# Altium schematic sheet 18-AM64x-07.SchDoc
size B; SheetNumber: 18; SheetTotal: 25
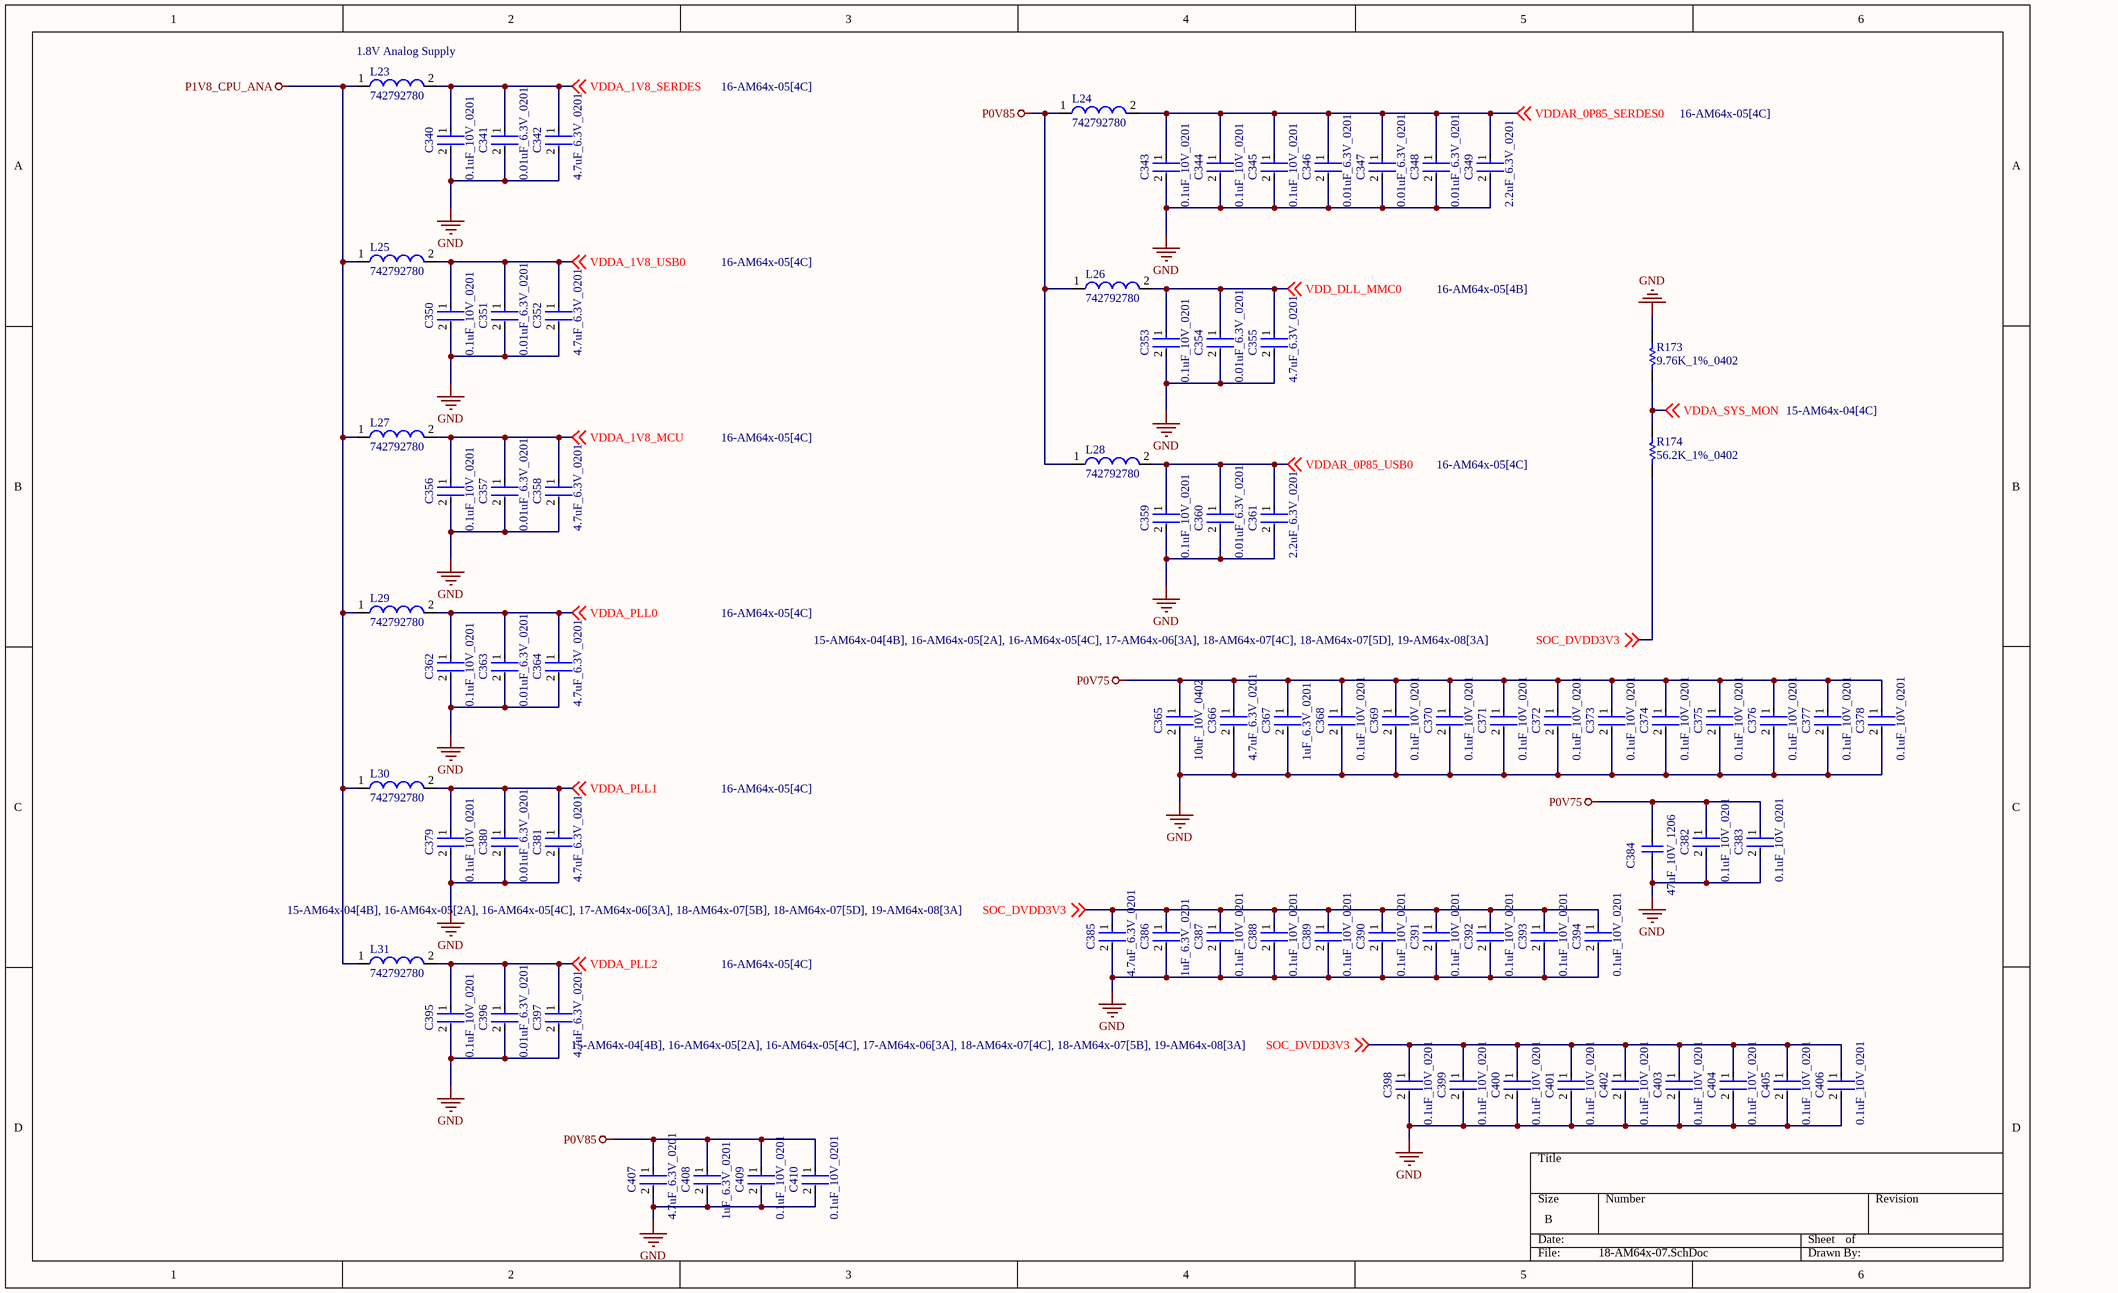
[diagram p0: 18-AM64x-07.SchDoc]

## Parts
C340  0.1uF_10V_0201  [FP-GRM033-0_03-IPC_C]
C341  0.01uF_6.3V_0201  [FP-GRM033-0_03-IPC_A]
C342  4.7uF_6.3V_0201  [FP-GRM035-0_09-IPC_B]
C343  0.1uF_10V_0201  [FP-GRM033-0_03-IPC_C]
C344  0.1uF_10V_0201  [FP-GRM033-0_03-IPC_C]
C345  0.1uF_10V_0201  [FP-GRM033-0_03-IPC_C]
C346  0.01uF_6.3V_0201  [FP-GRM033-0_03-IPC_A]
C347  0.01uF_6.3V_0201  [FP-GRM033-0_03-IPC_A]
C348  0.01uF_6.3V_0201  [FP-GRM033-0_03-IPC_A]
C349  2.2uF_6.3V_0201  [FP-CL03-IPC_C]
C350  0.1uF_10V_0201  [FP-GRM033-0_03-IPC_C]
C351  0.01uF_6.3V_0201  [FP-GRM033-0_03-IPC_A]
C352  4.7uF_6.3V_0201  [FP-GRM035-0_09-IPC_B]
C353  0.1uF_10V_0201  [FP-GRM033-0_03-IPC_C]
C354  0.01uF_6.3V_0201  [FP-GRM033-0_03-IPC_A]
C355  4.7uF_6.3V_0201  [FP-GRM035-0_09-IPC_B]
C356  0.1uF_10V_0201  [FP-GRM033-0_03-IPC_C]
C357  0.01uF_6.3V_0201  [FP-GRM033-0_03-IPC_A]
C358  4.7uF_6.3V_0201  [FP-GRM035-0_09-IPC_B]
C359  0.1uF_10V_0201  [FP-GRM033-0_03-IPC_C]
C360  0.01uF_6.3V_0201  [FP-GRM033-0_03-IPC_A]
C361  2.2uF_6.3V_0201  [FP-CL03-IPC_C]
C362  0.1uF_10V_0201  [FP-GRM033-0_03-IPC_C]
C363  0.01uF_6.3V_0201  [FP-GRM033-0_03-IPC_A]
C364  4.7uF_6.3V_0201  [FP-GRM035-0_09-IPC_B]
C365  10uF_10V_0402  [FP-CL05A106MP5NUNC-MFG]
C366  4.7uF_6.3V_0201  [FP-GRM035-0_09-IPC_B]
C367  1uF_6.3V_0201  [FP-CL03-IPC_B]
C368  0.1uF_10V_0201  [FP-GRM033-0_03-IPC_C]
C369  0.1uF_10V_0201  [FP-GRM033-0_03-IPC_C]
C370  0.1uF_10V_0201  [FP-GRM033-0_03-IPC_C]
C371  0.1uF_10V_0201  [FP-GRM033-0_03-IPC_C]
C372  0.1uF_10V_0201  [FP-GRM033-0_03-IPC_C]
C373  0.1uF_10V_0201  [FP-GRM033-0_03-IPC_C]
C374  0.1uF_10V_0201  [FP-GRM033-0_03-IPC_C]
C375  0.1uF_10V_0201  [FP-GRM033-0_03-IPC_C]
C376  0.1uF_10V_0201  [FP-GRM033-0_03-IPC_C]
C377  0.1uF_10V_0201  [FP-GRM033-0_03-IPC_C]
C378  0.1uF_10V_0201  [FP-GRM033-0_03-IPC_C]
C379  0.1uF_10V_0201  [FP-GRM033-0_03-IPC_C]
C380  0.01uF_6.3V_0201  [FP-GRM033-0_03-IPC_A]
C381  4.7uF_6.3V_0201  [FP-GRM035-0_09-IPC_B]
C382  0.1uF_10V_0201  [FP-GRM033-0_03-IPC_C]
C383  0.1uF_10V_0201  [FP-GRM033-0_03-IPC_C]
C384  47uF_10V_1206  [CAPC1206(3216)190_N]
C385  4.7uF_6.3V_0201  [FP-GRM035-0_09-IPC_B]
C386  1uF_6.3V_0201  [FP-CL03-IPC_B]
C387  0.1uF_10V_0201  [FP-GRM033-0_03-IPC_C]
C388  0.1uF_10V_0201  [FP-GRM033-0_03-IPC_C]
C389  0.1uF_10V_0201  [FP-GRM033-0_03-IPC_C]
C390  0.1uF_10V_0201  [FP-GRM033-0_03-IPC_C]
C391  0.1uF_10V_0201  [FP-GRM033-0_03-IPC_C]
C392  0.1uF_10V_0201  [FP-GRM033-0_03-IPC_C]
C393  0.1uF_10V_0201  [FP-GRM033-0_03-IPC_C]
C394  0.1uF_10V_0201  [FP-GRM033-0_03-IPC_C]
C395  0.1uF_10V_0201  [FP-GRM033-0_03-IPC_C]
C396  0.01uF_6.3V_0201  [FP-GRM033-0_03-IPC_A]
C397  4.7uF_6.3V_0201  [FP-GRM035-0_09-IPC_B]
C398  0.1uF_10V_0201  [FP-GRM033-0_03-IPC_C]
C399  0.1uF_10V_0201  [FP-GRM033-0_03-IPC_C]
C400  0.1uF_10V_0201  [FP-GRM033-0_03-IPC_C]
C401  0.1uF_10V_0201  [FP-GRM033-0_03-IPC_C]
C402  0.1uF_10V_0201  [FP-GRM033-0_03-IPC_C]
C403  0.1uF_10V_0201  [FP-GRM033-0_03-IPC_C]
C404  0.1uF_10V_0201  [FP-GRM033-0_03-IPC_C]
C405  0.1uF_10V_0201  [FP-GRM033-0_03-IPC_C]
C406  0.1uF_10V_0201  [FP-GRM033-0_03-IPC_C]
C407  4.7uF_6.3V_0201  [FP-GRM035-0_09-IPC_B]
C408  1uF_6.3V_0201  [FP-CL03-IPC_B]
C409  0.1uF_10V_0201  [FP-GRM033-0_03-IPC_C]
C410  0.1uF_10V_0201  [FP-GRM033-0_03-IPC_C]
L23  742792780  [SMD-0402]
L24  742792780  [SMD-0402]
L25  742792780  [SMD-0402]
L26  742792780  [SMD-0402]
L27  742792780  [SMD-0402]
L28  742792780  [SMD-0402]
L29  742792780  [SMD-0402]
L30  742792780  [SMD-0402]
L31  742792780  [SMD-0402]
R173  9.76K_1%_0402  [RESC1005X40X25NL05T10]
R174  56.2K_1%_0402  [RESC1005X40X25LL05T05]

## Nets
GND: C340.2 C341.2 C342.2 C343.2 C344.2 C345.2 C346.2 C347.2 C348.2 C349.2 C350.2 C351.2 C352.2 C353.2 C354.2 C355.2 C356.2 C357.2 C358.2 C359.2 C360.2 C361.2 C362.2 C363.2 C364.2 C365.2 C366.2 C367.2 C368.2 C369.2 C370.2 C371.2 C372.2 C373.2 C374.2 C375.2 C376.2 C377.2 C378.2 C379.2 C380.2 C381.2 C382.2 C383.2 C384.1 C385.2 C386.2 C387.2 C388.2 C389.2 C390.2 C391.2 C392.2 C393.2 C394.2 C395.2 C396.2 C397.2 C398.2 C399.2 C400.2 C401.2 C402.2 C403.2 C404.2 C405.2 C406.2 C407.2 C408.2 C409.2 C410.2 R173.1
P0V75: C365.1 C366.1 C367.1 C368.1 C369.1 C370.1 C371.1 C372.1 C373.1 C374.1 C375.1 C376.1 C377.1 C378.1 C382.1 C383.1 C384.2
P0V85: C407.1 C408.1 C409.1 C410.1 L24.1 L26.1 L28.1
P1V8_CPU_ANA: L23.1 L25.1 L27.1 L29.1 L30.1 L31.1
SOC_DVDD3V3: C385.1 C386.1 C387.1 C388.1 C389.1 C390.1 C391.1 C392.1 C393.1 C394.1 C398.1 C399.1 C400.1 C401.1 C402.1 C403.1 C404.1 C405.1 C406.1 R174.2 ; off-sheet SOC_DVDD3V3
VDD_DLL_MMC0: C353.1 C354.1 C355.1 L26.2 ; off-sheet VDD_DLL_MMC0
VDDA_1V8_MCU: C356.1 C357.1 C358.1 L27.2 ; off-sheet VDDA_1V8_MCU
VDDA_1V8_SERDES: C340.1 C341.1 C342.1 L23.2 ; off-sheet VDDA_1V8_SERDES
VDDA_1V8_USB0: C350.1 C351.1 C352.1 L25.2 ; off-sheet VDDA_1V8_USB0
VDDA_PLL0: C362.1 C363.1 C364.1 L29.2 ; off-sheet VDDA_PLL0
VDDA_PLL1: C379.1 C380.1 C381.1 L30.2 ; off-sheet VDDA_PLL1
VDDA_PLL2: C395.1 C396.1 C397.1 L31.2 ; off-sheet VDDA_PLL2
VDDA_SYS_MON: R173.2 R174.1 ; off-sheet VDDA_SYS_MON
VDDAR_0P85_SERDES0: C343.1 C344.1 C345.1 C346.1 C347.1 C348.1 C349.1 L24.2 ; off-sheet VDDAR_0P85_SERDES0
VDDAR_0P85_USB0: C359.1 C360.1 C361.1 L28.2 ; off-sheet VDDAR_0P85_USB0

## Notes on the sheet
- (near L23) 1.8V Analog Supply

## Library data of the parts
C340 C343-C345 C350 C353 C356 C359 C362 C368-C379 C382 C383 C387-C395 C398-C406 C409 C410 = CMP-2010-01264-2: Chip Multilayer Ceramic Capacitors for General Purpose, 0201, 0.10uF, X5R, 15%, 10%, 10V; Capacitance: 100nF; Mount: Surface Mount; Dielectric: X5R; Width: 0.012inch; Tolerance: 10%; Radiation Hardening: No; Voltage Rating: 10V; REACH SVHC: No SVHC; Height: 0.3mm; Max Operating Temperature: 85°C; Voltage Rating (DC): 10V; Thickness: 0.013inch; Termination: SMD/SMT; Lead Free: Lead Free; Package Quantity: 1; Case/Package: 0201; Min Operating Temperature: -55°C; Weight: 6E-06oz; Length: 0.6mm; Case Code (Imperial): 0201; Depth: 0.3mm; Voltage: 10V; Packaging: Tape and Reel; Case Code (Metric): 0603
C341 C346-C348 C351 C354 C357 C360 C363 C380 C396 = CMP-1033-00635-3: Chip Multilayer Ceramic Capacitors for General Purpose, 0201, 10000pF, X7R, 15%, 10%, 6.3V; Capacitance: 10nF; Lead Free: Lead Free; Max Operating Temperature: 125°C; Height: 0.3mm; REACH SVHC: No SVHC; Voltage Rating: 6.3V; Width: 0.012inch; Tolerance: 10%; Min Operating Temperature: -55°C; Length: 0.6mm; Voltage Rating (DC): 6.3V; Thickness: 0.013inch; Depth: 0.3mm; Case/Package: 0201; Case Code (Imperial): 0201; Packaging: Tape and Reel; Voltage: 6.3V; Package Quantity: 15000; Mount: Surface Mount; Case Code (Metric): 0603; Dielectric: X7R; Radiation Hardening: No; Termination: SMD/SMT
C342 C352 C355 C358 C364 C366 C381 C385 C397 C407 = CMP-06035-019701-1: Chip Multilayer Ceramic Capacitors for General Purpose, 0201, 4.7uF, X5R, 15%, 20%, 6.3V; Capacitance: 4.7uF; Max Operating Temperature: 85°C; Packaging: Tape and Reel; Voltage Rating: 6.3V; Min Operating Temperature: -55°C; Case/Package: 0201; Voltage Rating (DC): 6.3V; Tolerance: 20%; Length: 0.024inch; Dielectric: X5R; Case Code (Imperial): 0201; Case Code (Metric): 0603; Width: 0.012inch; Mount: Surface Mount; Thickness: 0.022inch
C349 C361 = CMP-13271-002641-1: Cap Ceramic 2.2uF 6.3V X5R ±20% Pad SMD 0201 +85°C T/R; Radiation Hardening: No; Case Code (Metric): 0603; Min Operating Temperature: -55°C; Case/Package: 0201; Mount: Surface Mount; Max Operating Temperature: 85°C; Case Code (Imperial): 0201; Capacitance: 2.2uF; Height: 0.3mm; Length: 0.6mm; Width: 0.012inch; Dielectric: X5R; Tolerance: 20%; Voltage Rating: 6.3V; Depth: 0.3mm; Packaging: Tape and Reel; Thickness: 0.013inch
C365 = CMP-13271-000002-1: CAP CER 10UF 10V X5R 0402; Manufacturer Part Number: CL05A106MP5NUNC; Manufacturer: Samsung; Temperature Coefficient: 15%; Tolerance: 20%; Material: Ceramic; Octopart: https://octopart.com/cl05a106mp5nunc-samsung-22457395; Voltage Rating: 10V; RoHS: TRUE; Value: 10uF; Height: 0.7mm; Digikey Description: CAP CER 10UF 10V X5R 0402; Automotive: No; Package: CL05A106MP5NUNC; Device Class L1: Passive Components; Capacitance: 10uF; Temperature Range High: +85°C; ComponentLink2Description: Datasheet; Device Class L2: Capacitors; Temperature Characteristic: X5R; Temperature: -55°C to +85°C; ComponentLink2URL: http://www.samsungsem.com/kr/support/product-search/mlcc/__icsFiles/afieldfile/2019/05/10/19-CL05A106MP5NUNC.pdf; Device Class L3: Ceramic Capacitors; Category: Cap; Temperature Range Low: -55°C; Ipc Land Pattern Name: CAPC10050X50; Lead Free: Yes
C367 C386 C408 = CMP-13271-002789-1: Cap Ceramic 1uF 6.3V X5R ±20% Pad SMD 0201 +85°C T/R; Tolerance: 20%; Voltage Rating: 6.3V; Mount: Surface Mount; Min Operating Temperature: -55°C; Package Quantity: 15000; Max Operating Temperature: 85°C; Height: 0.3mm; Packaging: Tape and Reel; Thickness: 0.013inch; Dielectric: X5R; Case/Package: 0201; Case Code (Imperial): 0201; Radiation Hardening: No; Case Code (Metric): 0603; Capacitance: 1uF; Width: 0.012inch; Depth: 0.3mm; Length: 0.6mm
C384 = CMP-1037-05002-1: CAP 47uF 10V ±20% 1206 (3216 Metric) Thickness 1.9mm SMD; Case-Metric: 3216; Case-EIA: 1206; Tolerance: Â±20%; Technology: SMT; Rated Voltage: 10 V; Value: 47uF; Max Thickness: 1.9 mm
L23-L31 = CMP-0220-00137-1: SMD EMI Suppression Ferrite Bead WE-CBF, Z = 220 Ohm; Impedance: 220 Ohm; PackageVersion: 2009; DatasheetVersion: ver 4, Jul-2009; PackageDescription: Chip Inductor, 2-Leads, Body 1.0 x 0.5 mm; ComponentLink1URL: http://www.we-online.com; ComponentLink1Description: Manufacturer Link; ComponentLink2URL: http://www.we-online.de/katalog/media/pdf/742792780.pdf; PackageReference: SMD-0402; ComponentLink2Description: Datasheet
R173 = CMP-1011-00622-2: Part Number: RC0402FR-079K76L; Manufacturer: Yageo / Phycomp
R174 = CMP-2002-00996-1: Part Number: ERJ-2RKF5622X; Manufacturer: Panasonic